# Altium schematic sheet FRM-X33_LAN_UART Adapter.SchDoc
size A
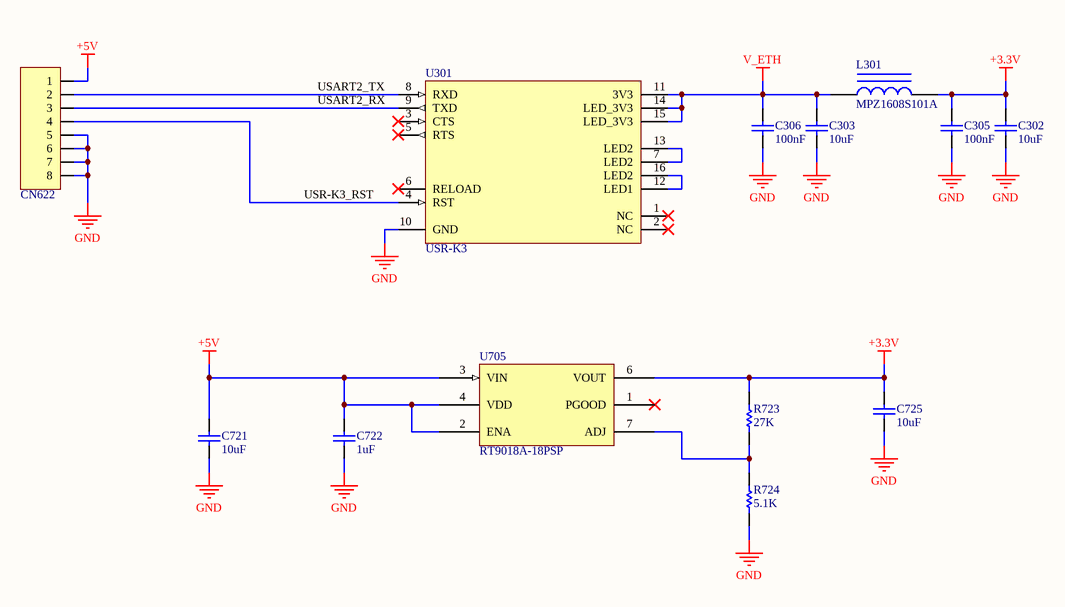
[diagram p0: FRM-X33_LAN_UART Adapter.SchDoc]

## Parts
C302  value 10uF  [0805C]  (hidden comment: C2012X7R1A106K)
C303  value 10uF  [0805C]  (hidden comment: C2012X7R1A106K)
C305  value 100nF  [0603C]  (hidden comment: C1608X7R1E104K)
C306  value 100nF  [0603C]  (hidden comment: C1608X7R1E104K)
C721  value 10uF  [0805C]  (hidden comment: C2012X7R1A106K)
C722  value 1uF  [0603C]  (hidden comment: C1608X7R1E105K)
C725  value 10uF  [0805C]  (hidden comment: C2012X7R1A106K)
CN622  B8B-PH-K-S  [B8B-PH-K-S]  (value not drawn)
L301  MPZ1608S101A  [0603R]
R723  value 27K  [0603R]  (hidden comment: ERJ3GEYJ472V)
R724  value 5.1K  [0603R]  (hidden comment: ERJ3GEYJ472V)
U301  USR-K3  [USR-K3]
U705  RT9018A-18PSP  [SOP_8]

## Nets
+3.3V: C302.1 C305.1 C725.1 L301.2 R723.2 U705.6(VOUT)
+5V: C721.1 C722.1 CN622.1 U705.2(ENA) U705.3(VIN) U705.4(VDD)
GND: C302.2 C303.2 C305.2 C306.2 C721.2 C722.2 C725.2 CN622.5 CN622.6 CN622.7 CN622.8 R724.1 U301.10(GND) U705.8(GND) U705.9(GND)
V_ETH: C303.1 C306.1 L301.1 U301.11(3V3) U301.14(LED_3V3) U301.15(LED_3V3)
USART2_RX: CN622.3 U301.9(TXD)
USART2_TX: CN622.2 U301.8(RXD)
USR-K3_RST: CN622.4 U301.4(RST)
NetR723_1: R723.1 R724.2 U705.7(ADJ)
NetU301_7: U301.7(LED2) U301.13(LED2)
NetU301_12: U301.12(LED1) U301.16(LED2)

Not connected (* = marked no-connect by the designer): U301 1(NC)* 2(NC)* 3(CTS)* 5(RTS)* 6(RELOAD)*; U705 1(PGOOD)* 5(NC)

## Library data of the parts
C302 C303 C721 C725 = C2012X7R1A106K: Capacitor,Ceramic,10uF,10V,X7R,10%; Manufacture: TDK
C305 C306 = C1608X7R1E104K: Capacitor,Ceramic,100nF,25V,X7R,10%; Manufacture: TDK
C722 = C1608X7R1E105K: Capacitor,Ceramic,1uF,25V,X7R,10%; Manufacture: TDK
CN622 = B8B-PH-K-S_ROW: 8 Position 2mm Pitch/Disconnectable Crimp style Connectors; Manufacture: JST Sales America Inc.
L301 = MPZ1608S101A: Bead, Ferrite,100R@100Mhz,3A; Manufacture: TDK
R723 R724 = ERJ3GEYJ472V: Thick Film Chip Resistors,4.7K,0603,5%; Manufacture: Panasonic
U705 = RT9018A-18PSP: Maximum 3A, Ultra Low Dropout Regulator; Manufacture: RICHTEK